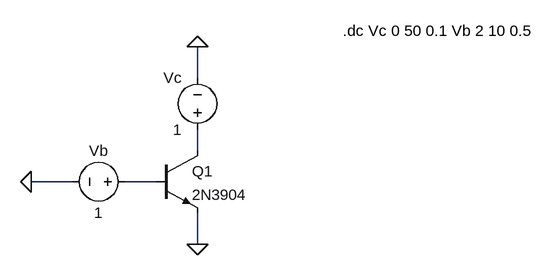
[diagram p0: schematic Test_Q1_Q2_Q6_Q9.asc]
Test_Q1_Q2_Q6_Q9.asc, the LTspice schematic file:
Version 4
SHEET 1 1288 936
WIRE 128 528 128 480
WIRE 128 640 128 608
WIRE -64 688 -128 688
WIRE 64 688 16 688
WIRE 128 784 128 736
FLAG -128 688 0
FLAG 128 480 0
FLAG 128 784 0
SYMBOL Voltage 128 624 R180
WINDOW 0 24 96 Left 2
WINDOW 3 24 16 Left 2
SYMATTR InstName Vc
SYMATTR Value 1
SYMBOL Voltage 32 688 R90
WINDOW 0 -32 56 VBottom 2
WINDOW 3 32 56 VTop 2
SYMATTR InstName Vb
SYMATTR Value 1
SYMBOL npn 64 640 R0
SYMATTR InstName Q1
SYMATTR Value 2N3904
TEXT 352 456 Left 2 !.dc Vc 0 50 0.1 Vb 2 10 0.5

The netlist it stands for:
* Test_Q1_Q2_Q6_Q9.asc
Vc N001 0 1
Vb N002 0 1
Q1 N001 N002 0 0 2N3904
.model NPN NPN
.model PNP PNP
.lib standard.bjt
.dc Vc 0 50 0.1 Vb 2 10 0.5
.backanno
.end